# Altium schematic sheet BMI160.SchDoc
size A4
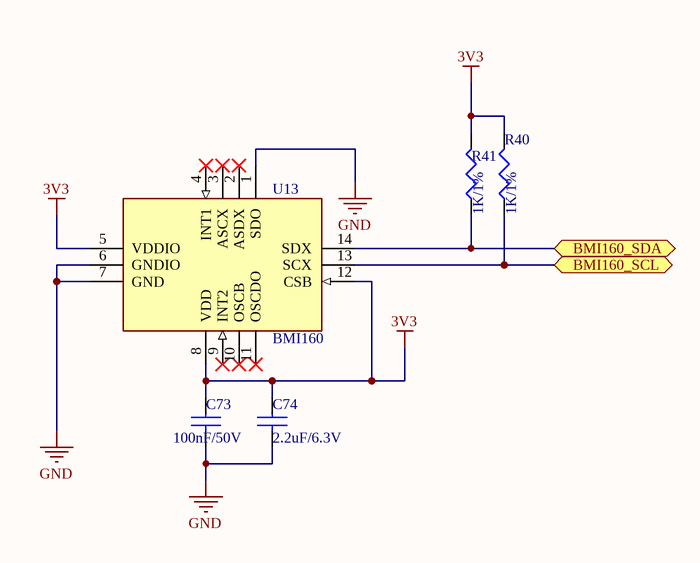
[diagram p0: BMI160.SchDoc]

## Parts
C73  100nF/50V  [C0402]
C74  2.2uF/6.3V  [C0402]
R40  1K/1%  [R0402]
R41  1K/1%  [R0402]
U13  BMI160  [PQFN50P300X250X88-14N]

## Ports
BMI160_SCL (bidir, see VESC_75100[2C]), BMI160_SDA (bidir, see VESC_75100[2C])

## Nets
3V3: C73.1 C74.1 R40.2 R41.2 U13.5(VDDIO) U13.8(VDD) U13.12(CSB)
GND: C73.2 C74.2 U13.1(SDO) U13.6(GNDIO) U13.7(GND)
BMI160_SCL: R40.1 U13.13(SCX) ; port BMI160_SCL
BMI160_SDA: R41.1 U13.14(SDX) ; port BMI160_SDA

Not connected (* = marked no-connect by the designer): U13 2(ASDX)* 3(ASCX)* 4(INT1)* 9(INT2)* 10(OSCB)* 11(OSCDO)*

## Library data of the parts
C73 C74 = CAP NP: PCB Footprint: C0402
R40 R41 = RESISTOR: PCB Footprint: R0402
U13 = BMI160: Integrated Circuit; Manufacturer_Name: BOSCH; Datasheet Link: https://datasheet.datasheetarchive.com/originals/distributors/DKDS41/DSANUWW0031095.pdf; Height: 0.88mm; Manufacturer_Part_Number: BMI160; Mouser Part Number: 262-BMI160; Mouser Price/Stock: https://www.mouser.co.uk/ProductDetail/Bosch-Sensortec/BMI160?qs=Lj1LZLjqIN1DEsUDgjehlg%3D%3D; Arrow Part Number: BMI160; Arrow Price/Stock: https://www.arrow.com/en/products/bmi160/bosch?region=nac